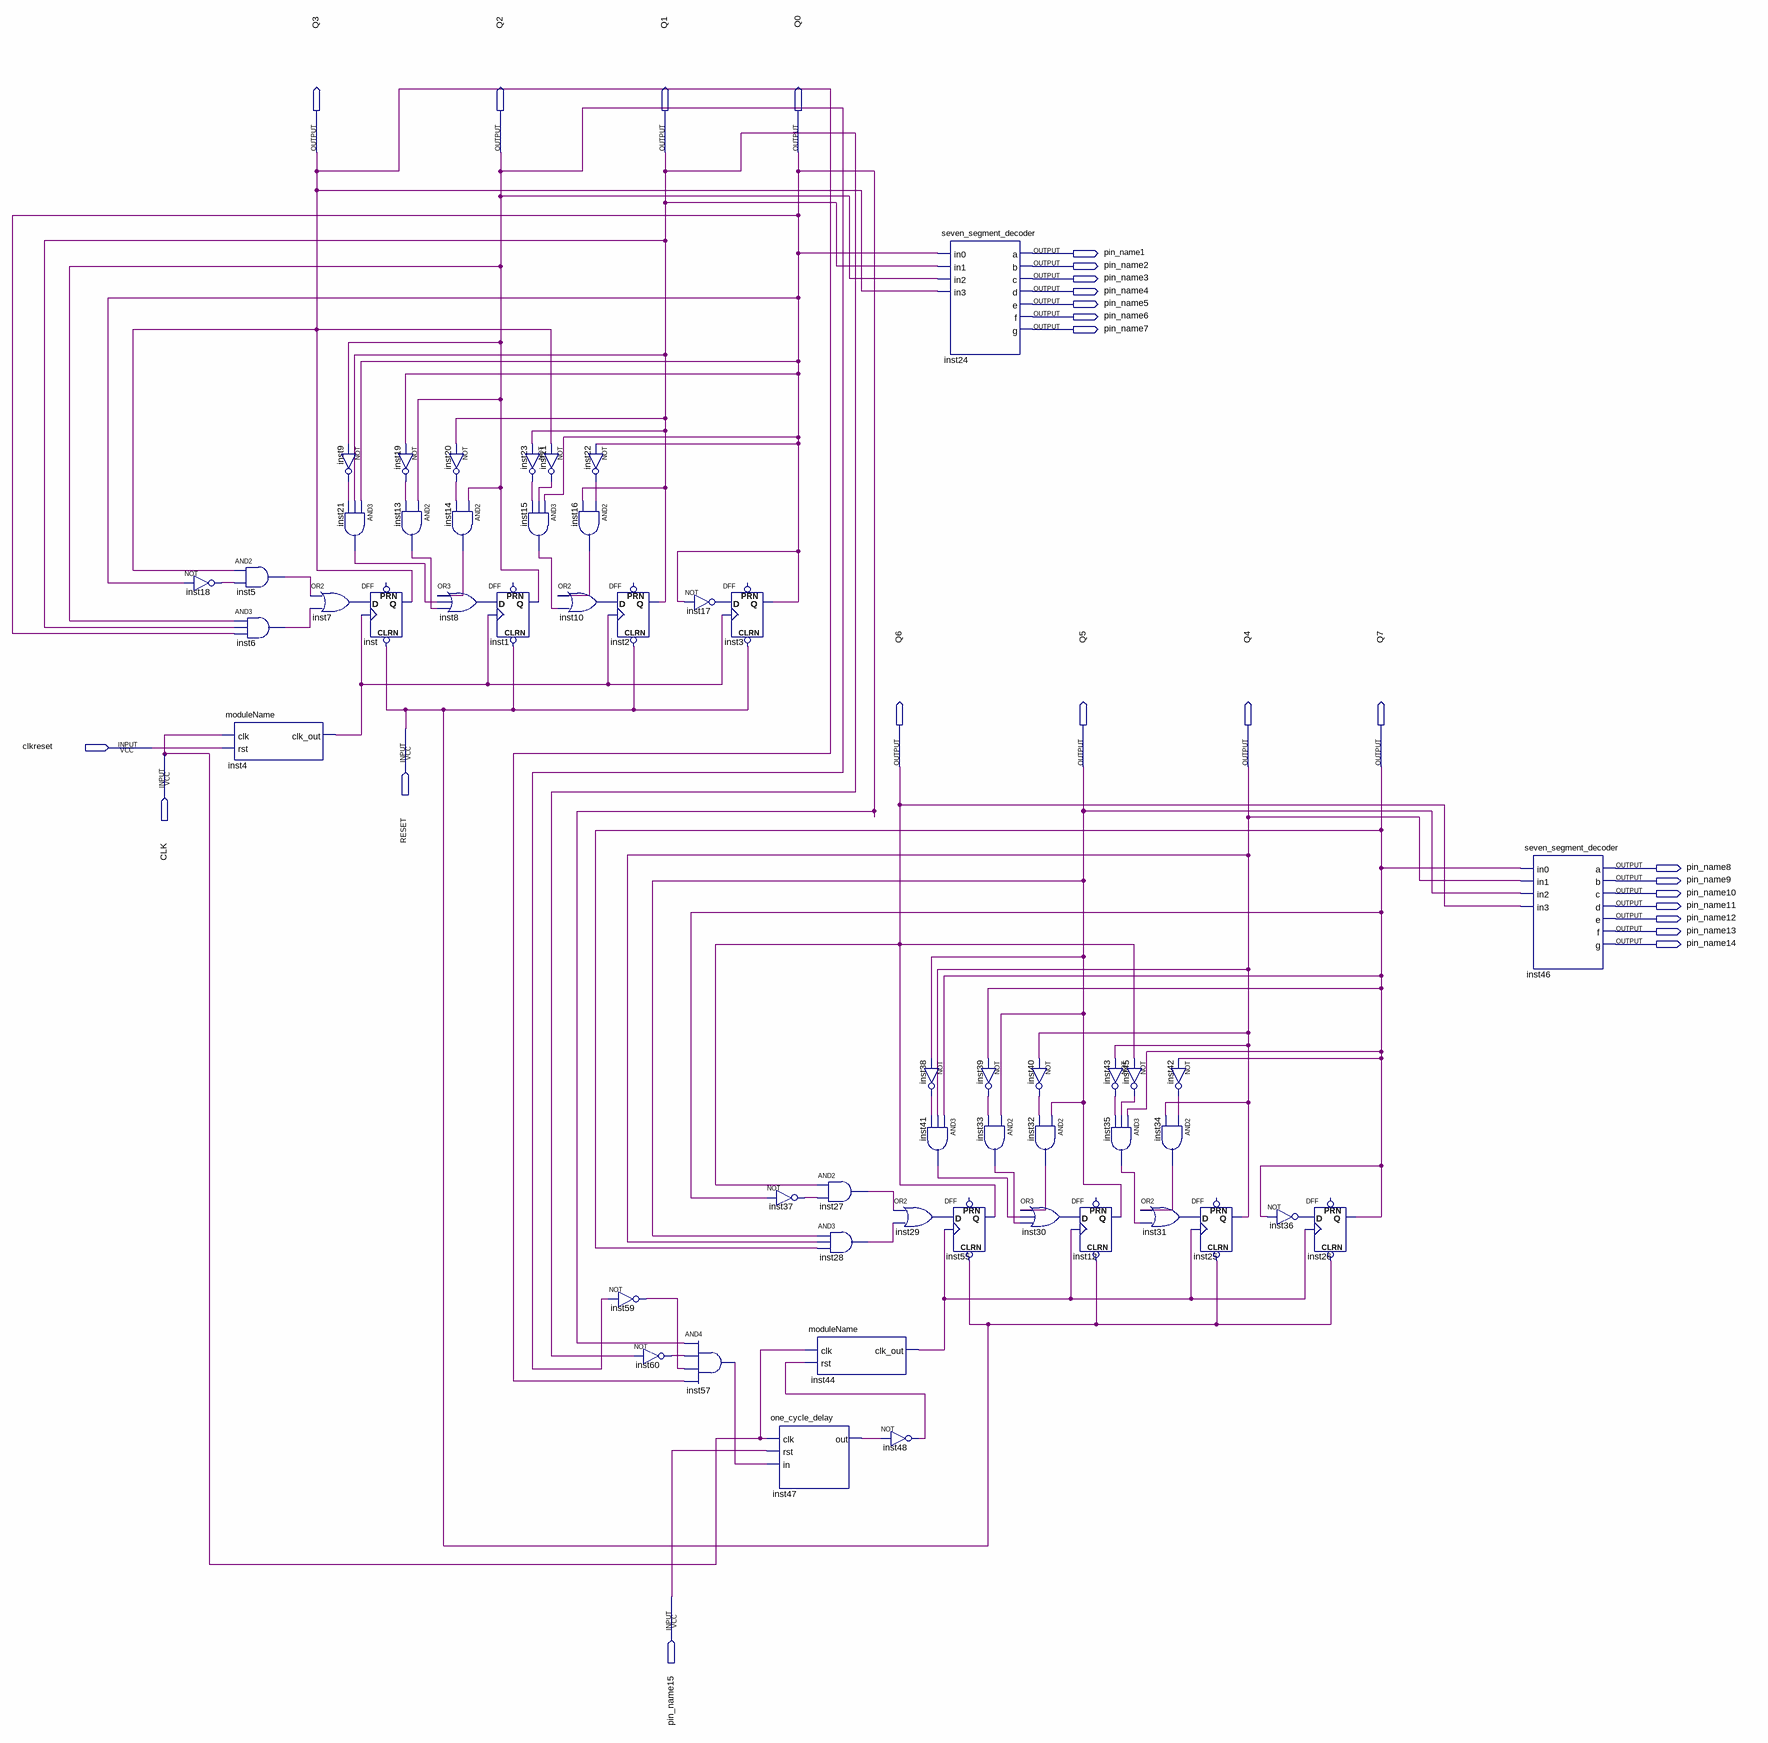
[diagram p0: schematic sheet]
// Quartus schematic lab.bdf as structural Verilog: 53 symbols, 26 pins
module lab (
  input  RESET,
  input  clkreset,
  input  CLK,
  input  pin_name15,
  output Q3,
  output Q2,
  output Q1,
  output Q0,
  output pin_name1,
  output pin_name2,
  output pin_name3,
  output pin_name4,
  output pin_name5,
  output pin_name6,
  output pin_name7,
  output Q6,
  output Q5,
  output Q4,
  output Q7,
  output pin_name8,
  output pin_name9,
  output pin_name10,
  output pin_name11,
  output pin_name12,
  output pin_name13,
  output pin_name14
);

  wire inst4_clk_out, inst5_out, inst6_out, inst7_out, inst8_out, inst9_out, inst10_out, inst11_out,
       inst13_out, inst14_out, inst15_out, inst16_out, inst17_out, inst18_out, inst19_out, inst20_out,
       inst21_out, inst22_out, inst23_out, inst27_out, inst28_out, inst29_out, inst30_out, inst31_out,
       inst32_out, inst33_out, inst34_out, inst35_out, inst36_out, inst37_out, inst38_out, inst39_out,
       inst40_out, inst41_out, inst42_out, inst43_out, inst44_clk_out, inst45_out, inst47_out, inst48_out,
       inst57_out, inst59_out, inst60_out;

  not inst18 (inst18_out, Q0);
  moduleName inst4 (.clk(CLK), .rst(clkreset), .clk_out(inst4_clk_out));
  and inst5 (inst5_out, Q3, inst18_out);
  and inst6 (inst6_out, Q2, Q1, Q0);
  or inst7 (inst7_out, inst5_out, inst6_out);
  not inst9 (inst9_out, Q2);
  and inst21 (inst21_out, Q0, Q1, inst9_out);
  DFF inst (.CLRN(RESET), .CLK(inst4_clk_out), .D(inst7_out), .Q(Q3));  // open: PRN
  not inst19 (inst19_out, Q0);
  and inst13 (inst13_out, Q2, inst19_out);
  not inst20 (inst20_out, Q1);
  and inst14 (inst14_out, Q2, inst20_out);
  or inst8 (inst8_out, inst14_out, inst21_out, inst13_out);
  not inst23 (inst23_out, Q1);
  and inst15 (inst15_out, Q0, inst11_out, inst23_out);
  DFF inst1 (.CLRN(RESET), .CLK(inst4_clk_out), .D(inst8_out), .Q(Q2));  // open: PRN
  not inst11 (inst11_out, Q3);
  and inst16 (inst16_out, inst22_out, Q1);
  or inst10 (inst10_out, inst16_out, inst15_out);
  not inst22 (inst22_out, Q0);
  DFF inst2 (.CLRN(RESET), .CLK(inst4_clk_out), .D(inst10_out), .Q(Q1));  // open: PRN
  not inst59 (inst59_out, Q2);
  not inst60 (inst60_out, Q1);
  DFF inst3 (.CLRN(RESET), .CLK(inst4_clk_out), .D(inst17_out), .Q(Q0));  // open: PRN
  not inst17 (inst17_out, Q0);
  and inst57 (inst57_out, Q0, inst60_out, inst59_out, Q3);
  not inst37 (inst37_out, Q7);
  one_cycle_delay inst47 (.clk(CLK), .rst(pin_name15), .in(inst57_out), .out(inst47_out));
  and inst27 (inst27_out, Q6, inst37_out);
  and inst28 (inst28_out, Q5, Q4, Q7);
  moduleName inst44 (.clk(CLK), .rst(inst48_out), .clk_out(inst44_clk_out));
  not inst48 (inst48_out, inst47_out);
  not inst38 (inst38_out, Q5);
  and inst41 (inst41_out, Q7, Q4, inst38_out);
  or inst29 (inst29_out, inst27_out, inst28_out);
  seven_segment_decoder inst24 (
    .in0(Q0), .in1(Q1), .in2(Q2), .in3(Q3), .a(pin_name1), .b(pin_name2), .c(pin_name3), .d(pin_name4),
    .e(pin_name5), .f(pin_name6), .g(pin_name7));
  not inst39 (inst39_out, Q7);
  and inst33 (inst33_out, Q5, inst39_out);
  DFF inst55 (.CLRN(RESET), .CLK(inst44_clk_out), .D(inst29_out), .Q(Q6));  // open: PRN
  not inst40 (inst40_out, Q4);
  and inst32 (inst32_out, Q5, inst40_out);
  or inst30 (inst30_out, inst32_out, inst41_out, inst33_out);
  DFF inst12 (.CLRN(RESET), .CLK(inst44_clk_out), .D(inst30_out), .Q(Q5));  // open: PRN
  not inst43 (inst43_out, Q4);
  not inst45 (inst45_out, Q6);
  and inst35 (inst35_out, Q7, inst45_out, inst43_out);
  not inst42 (inst42_out, Q7);
  and inst34 (inst34_out, inst42_out, Q4);
  or inst31 (inst31_out, inst34_out, inst35_out);
  DFF inst25 (.CLRN(RESET), .CLK(inst44_clk_out), .D(inst31_out), .Q(Q4));  // open: PRN
  not inst36 (inst36_out, Q7);
  DFF inst26 (.CLRN(RESET), .CLK(inst44_clk_out), .D(inst36_out), .Q(Q7));  // open: PRN
  seven_segment_decoder inst46 (
    .in0(Q7), .in1(Q4), .in2(Q5), .in3(Q6), .a(pin_name8), .b(pin_name9), .c(pin_name10), .d(pin_name11),
    .e(pin_name12), .f(pin_name13), .g(pin_name14));
endmodule
